# Altium project HIVE_SIGHT.PrjPcb (part 2 of 2)

## Sheet HIVE_SIGHT_WIRELESS.SchDoc
size Tabloid; SheetNumber: 5; SheetTotal: 6; Sheet_Name: WIRELESS; Size: 11x17
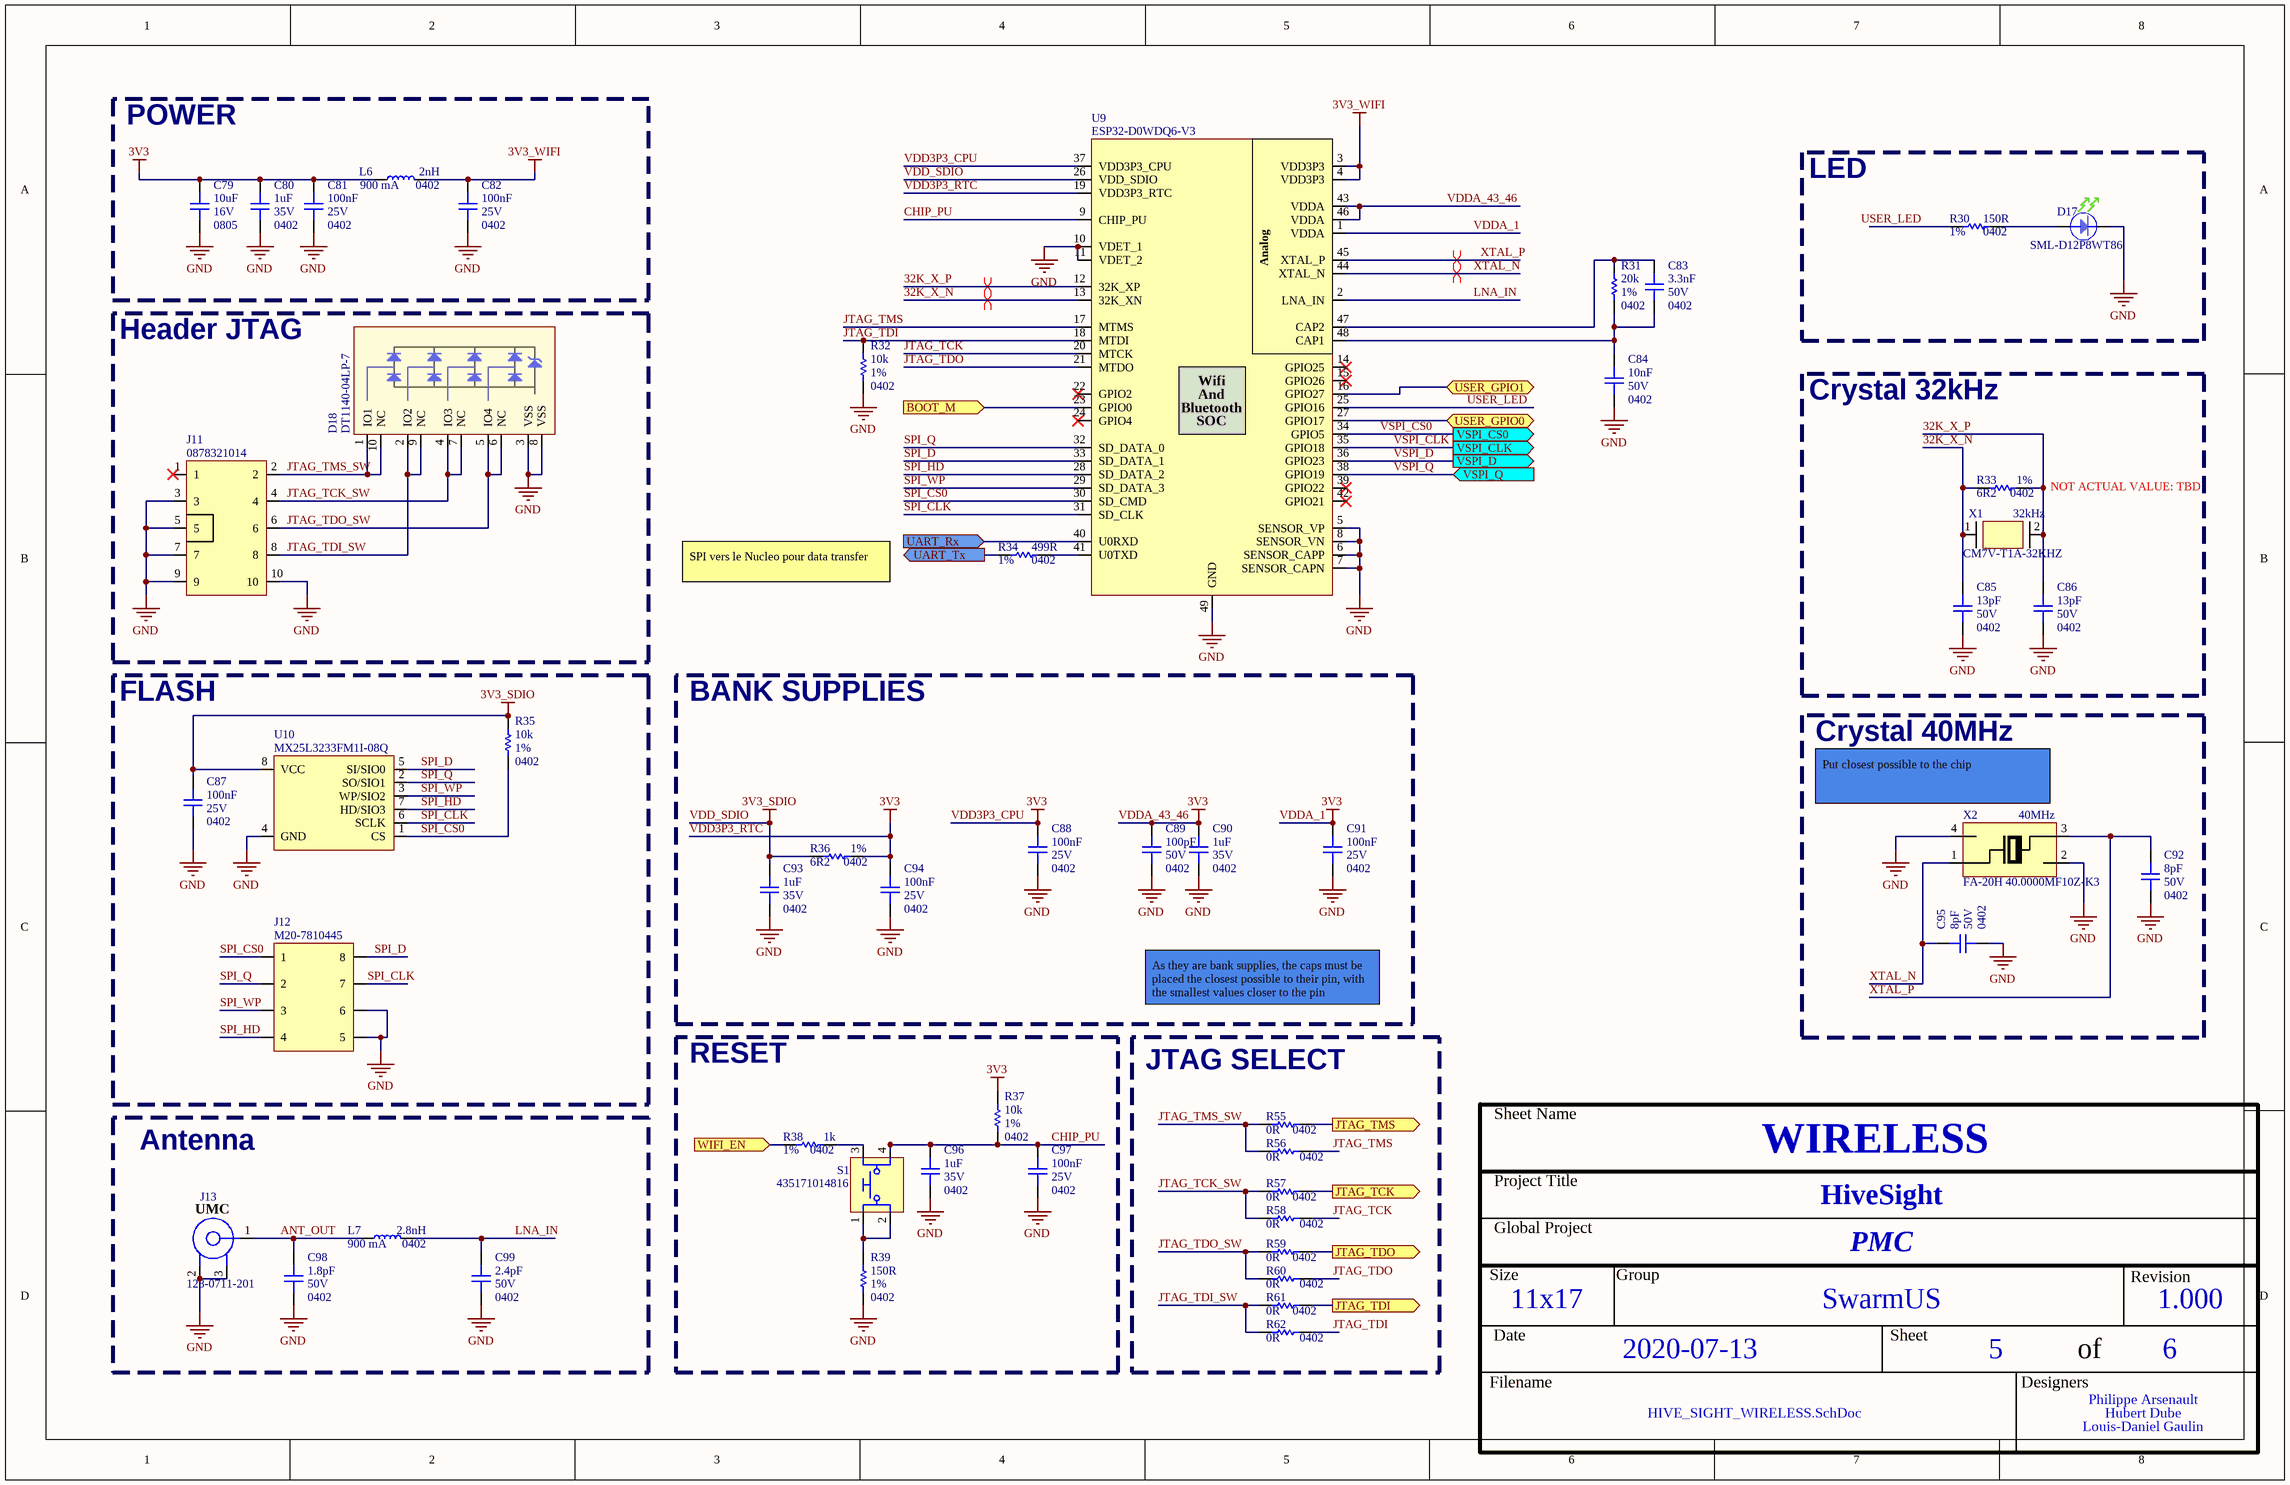
[diagram p3: HIVE_SIGHT_WIRELESS.SchDoc]

### Parts
C79  value 10uF  Package: 0805  Voltage Rating: 16V  [CAP_CER_0805]  (hidden comment: GRM21BR61C106KE15K)
C80  value 1uF  Package: 0402  Voltage Rating: 35V  [CAP_CER_0402]  (hidden comment: CL05A105KL5NRNC)
C81  value 100nF  Package: 0402  Voltage Rating: 25V  [CAP_CER_0402]  (hidden comment: CGA2B3X7R1E104K050BB)
C82  value 100nF  Package: 0402  Voltage Rating: 25V  [CAP_CER_0402]  (hidden comment: CGA2B3X7R1E104K050BB)
C83  value 3.3nF  Package: 0402  Voltage Rating: 50V  [CAP_CER_0402]  (hidden comment: C0402C332K5RACAUTO)
C84  value 10nF  Package: 0402  Voltage Rating: 50V  [CAP_CER_0402]  (hidden comment: CL05B103KB5NFNC)
C85  value 13pF  Package: 0402  Voltage Rating: 50V  [CAP_CER_0402]  (hidden comment: CC0402JRNPO9BN130)
C86  value 13pF  Package: 0402  Voltage Rating: 50V  [CAP_CER_0402]  (hidden comment: CC0402JRNPO9BN130)
C87  value 100nF  Package: 0402  Voltage Rating: 25V  [CAP_CER_0402]  (hidden comment: CGA2B3X7R1E104K050BB)
C88  value 100nF  Package: 0402  Voltage Rating: 25V  [CAP_CER_0402]  (hidden comment: CGA2B3X7R1E104K050BB)
C89  value 100pF  Package: 0402  Voltage Rating: 50V  [CAP_CER_0402]  (hidden comment: CC0402JRNPO9BN101)
C90  value 1uF  Package: 0402  Voltage Rating: 35V  [CAP_CER_0402]  (hidden comment: CL05A105KL5NRNC)
C91  value 100nF  Package: 0402  Voltage Rating: 25V  [CAP_CER_0402]  (hidden comment: CGA2B3X7R1E104K050BB)
C92  value 8pF  Package: 0402  Voltage Rating: 50V  [CAP_CER_0402]  (hidden comment: CC0402DRNPO9BN8R0)
C93  value 1uF  Package: 0402  Voltage Rating: 35V  [CAP_CER_0402]  (hidden comment: CL05A105KL5NRNC)
C94  value 100nF  Package: 0402  Voltage Rating: 25V  [CAP_CER_0402]  (hidden comment: CGA2B3X7R1E104K050BB)
C95  value 8pF  Package: 0402  Voltage Rating: 50V  [CAP_CER_0402]  (hidden comment: CC0402DRNPO9BN8R0)
C96  value 1uF  Package: 0402  Voltage Rating: 35V  [CAP_CER_0402]  (hidden comment: CL05A105KL5NRNC)
C97  value 100nF  Package: 0402  Voltage Rating: 25V  [CAP_CER_0402]  (hidden comment: CGA2B3X7R1E104K050BB)
C98  value 1.8pF  Package: 0402  Voltage Rating: 50V  [CAP_CER_0402]  (hidden comment: CC0402CRNPO9BN1R8)
C99  value 2.4pF  Package: 0402  Voltage Rating: 50V  [CAP_CER_0402]  (hidden comment: CC0402BRNPO9BN2R4)
D17  SML-D12P8WT86  [LED_SML-D12P8WT86]
D18  DT1140-04LP-7  [TVS_DATA_DT1140-04LP-7]
J11  0878321014  [CON_0878321014]
J12  M20-7810445  [CON_HDR_M20-7810445R]
J13  128-0711-201  [CON_UMC_128-0711-201]
L6  value 2nH  Current Rating: 900 mA  Package: 0402  [FER_0402]  (hidden comment: LQG15HS2N0S02D)
L7  value 2.8nH  Current Rating: 900 mA  Package: 0402  [FER_0402]  (hidden comment: LQG15WZ2N8S02D)
R30  value 150R  Tolerance: 1%  Package: 0402  [RES_0402]  (hidden comment: RC0402FR-07150RL)
R31  value 20k  Tolerance: 1%  Package: 0402  [RES_0402]  (hidden comment: RC0402FR-0720KL)
R32  value 10k  Tolerance: 1%  Package: 0402  [RES_0402]  (hidden comment: RC0402FR-0710KL)
R33  value 6R2  Tolerance: 1%  Package: 0402  [RES_0402]  (hidden comment: RC0402FR-076R2L)
R34  value 499R  Tolerance: 1%  Package: 0402  [RES_0402]  (hidden comment: RC0402FR-07499RL)
R35  value 10k  Tolerance: 1%  Package: 0402  [RES_0402]  (hidden comment: RC0402FR-0710KL)
R36  value 6R2  Tolerance: 1%  Package: 0402  [RES_0402]  (hidden comment: RC0402FR-076R2L)
R37  value 10k  Tolerance: 1%  Package: 0402  [RES_0402]  (hidden comment: RC0402FR-0710KL)
R38  value 1k  Tolerance: 1%  Package: 0402  [RES_0402]  (hidden comment: RC0402FR-071KL)
R39  value 150R  Tolerance: 1%  Package: 0402  [RES_0402]  (hidden comment: RC0402FR-07150RL)
R55  value 0R  Package: 0402  [RES_0402]  (hidden comment: RC0402FR-070RL)
R56  value 0R  Package: 0402  [RES_0402]  (hidden comment: RC0402FR-070RL)
R57  value 0R  Package: 0402  [RES_0402]  (hidden comment: RC0402FR-070RL)
R58  value 0R  Package: 0402  [RES_0402]  (hidden comment: RC0402FR-070RL)
R59  value 0R  Package: 0402  [RES_0402]  (hidden comment: RC0402FR-070RL)
R60  value 0R  Package: 0402  [RES_0402]  (hidden comment: RC0402FR-070RL)
R61  value 0R  Package: 0402  [RES_0402]  (hidden comment: RC0402FR-070RL)
R62  value 0R  Package: 0402  [RES_0402]  (hidden comment: RC0402FR-070RL)
S1  435171014816  [SWI_TACT_435171014816]
U9  ESP32-D0WDQ6-V3  [COM_WIFI_ESP32-D0WDQ6-V3]
U10  MX25L3233FM1I-08Q  [MEM_FLASH_MX25L3233FM1I-08Q]
X1  CM7V-T1A-32KHZ  value 32kHz  [CRY_CM7V-T1A-32.768KHZ-12.5PF-20PPM-TA-QC]
X2  FA-20H 40.0000MF10Z-K3  value 40MHz  [CRY_FA-20H 40.0000MF10Z-K3]

### Blocks framed on the sheet
POWER: C79-C82 L6
LED: D17 R30
Header JTAG: D18 J11
Crystal 32kHz: C85 C86 R33 X1
FLASH: C87 J12 R35 U10
BANK SUPPLIES: C88-C91 C93 C94 R36
Crystal 40MHz: C92 C95 X2
JTAG SELECT: R55-R62
Antenna: C98 C99 J13 L7

### Ports
BOOT_M (in), JTAG_TCK (out), JTAG_TDI (out), JTAG_TDO (out), JTAG_TMS (out), UART_Rx (in), UART_Tx (out), USER_GPIO0 (bidir), USER_GPIO1 (bidir), VSPI_CLK (out), VSPI_CS0 (out), VSPI_D (out), VSPI_Q (in), WIFI_EN (in)

### Nets
3V3: C79.2 C80.2 C81.2 C88.2 C89.2 C90.2 C91.2 C94.2 L6.1 R36.1 R37.2 U9.1(VDDA) U9.19(VDD3P3_RTC) U9.37(VDD3P3_CPU) U9.43(VDDA) U9.46(VDDA)  [also labelled VDD3P3_CPU, VDD3P3_RTC, VDDA_1, VDDA_43_46]
3V3_SDIO: C87.2 C93.2 R35.2 R36.2 U9.26(VDD_SDIO) U10.8(VCC)  [also labelled VDD_SDIO]
3V3_WIFI: C82.2 L6.2 U9.3(VDD3P3) U9.4(VDD3P3)
GND: C79.1 C80.1 C81.1 C82.1 C84.1 C85.1 C86.1 C87.1 C88.1 C89.1 C90.1 C91.1 C92.1 C93.1 C94.1 C95.1 C96.1 C97.1 C98.1 C99.1 D17.K D18.3(VSS) D18.8(VSS) J11.3 J11.5 J11.7 J11.9 J11.10 J12.5 J12.6 J13.2 J13.3 R32.1 R39.1 U9.5(SENSOR_VP) U9.6(SENSOR_CAPP) U9.7(SENSOR_CAPN) U9.8(SENSOR_VN) U9.10(VDET_1) U9.11(VDET_2) U9.49(GND) U10.4(GND) X2.2 X2.4
32K_X_N: C85.2 R33.2 U9.13(32K_XN) X1.1(In/Out)
32K_X_P: C86.2 R33.1 U9.12(32K_XP) X1.2(Out/In)
ANT_OUT: C98.2 J13.1 L7.1
CHIP_PU: C96.2 C97.2 R37.1 S1.4 U9.9(CHIP_PU)
JTAG_TCK: R58.1 U9.20(MTCK)
JTAG_TCK_SW: D18.4(IO3) D18.7(NC) J11.4 R57.2 R58.2
JTAG_TDI: R32.2 R62.1 U9.18(MTDI)
JTAG_TDI_SW: D18.2(IO2) D18.9(NC) J11.8 R61.2 R62.2
JTAG_TDO: R60.1 U9.21(MTDO)
JTAG_TDO_SW: D18.5(IO4) D18.6(NC) J11.6 R59.2 R60.2
JTAG_TMS: R56.1 U9.17(MTMS)
JTAG_TMS_SW: D18.1(IO1) D18.10(NC) J11.2 R55.2 R56.2
LNA_IN: C99.2 L7.2 U9.2(LNA_IN)
SPI_CLK: J12.7 U9.31(SD_CLK) U10.6(SCLK)
SPI_CS0: J12.1 R35.1 U9.30(SD_CMD) U10.1(CS)
SPI_D: J12.8 U9.33(SD_DATA_1) U10.5(SI/SIO0)
SPI_HD: J12.4 U9.28(SD_DATA_2) U10.7(HD/SIO3)
SPI_Q: J12.2 U9.32(SD_DATA_0) U10.2(SO/SIO1)
SPI_WP: J12.3 U9.29(SD_DATA_3) U10.3(WP/SIO2)
USER_LED: R30.2 U9.25(GPIO16)
VSPI_CLK: U9.35(GPIO18) ; port VSPI_CLK
VSPI_CS0: U9.34(GPIO5) ; port VSPI_CS0
VSPI_D: U9.36(GPIO23) ; port VSPI_D
VSPI_Q: U9.38(GPIO19) ; port VSPI_Q
XTAL_N: C95.2 U9.44(XTAL_N) X2.1
XTAL_P: C92.2 U9.45(XTAL_P) X2.3
NetC83_1: C83.1 C84.2 R31.1 U9.48(CAP1)
NetC83_2: C83.2 R31.2 U9.47(CAP2)
NetD17_A: D17.A R30.1
NetR34_1: R34.1 U9.41(U0TXD)
NetR34_2: R34.2 ; port UART_Tx
NetR38_1: R38.1 S1.3
NetR38_2: R38.2 ; port WIFI_EN
NetR39_2: R39.2 S1.1 S1.2
NetR55_1: R55.1 ; port JTAG_TMS
NetR57_1: R57.1 ; port JTAG_TCK
NetR59_1: R59.1 ; port JTAG_TDO
NetR61_1: R61.1 ; port JTAG_TDI
NetU9_16: U9.16(GPIO27) ; port USER_GPIO1
NetU9_23: U9.23(GPIO0) ; port BOOT_M
NetU9_27: U9.27(GPIO17) ; port USER_GPIO0
NetU9_40: U9.40(U0RXD) ; port UART_Rx

Not connected (* = marked no-connect by the designer): J11 1*; U9 14(GPIO25)* 15(GPIO26)* 22(GPIO2)* 24(GPIO4)* 39(GPIO22)* 42(GPIO21)*

### Layout directives
differential pair: 32K_X_N, 32K_X_P, XTAL_N, XTAL_P

### Notes on the sheet
- NOT ACTUAL VALUE: TBD
- SPI vers le Nucleo pour data transfer
- (near X2) Put closest possible to the chip
- As they are bank supplies, the caps must be placed the closest possible to their pin, with the smallest values closer to the pin
- RESET
- Sheet Name
- Project Title
- Global Project
- Size
- Group
- Revision
- Date
- Sheet
- of
- Filename
- Designers
- (in symbol COM_WIFI_ESP32-D0WDQ6-V3) Analog; Wifi; And; Bluetooth; SOC
- (in symbol CON_UMC_128-0711-201) UMC

### Library data of the parts
C79 = CAP_CER_GRM21BR61C106KE15K: CAP - CER 10UF 10% 16V X5R - 0805; Manufacturer #1: Murata; GRAMS Lib Spec: 2.8; Magnetic Material: Unknown; Polarized: NO; Assembly Type: SMD; CreatedBy/Date: Caroline Paulin / 8 août 2018; Current Rating: *; HelpURL: https://search.murata.co.jp/Ceramy/image/img/A01X/G101/ENG/GRM21BR61C106KE15-01.pdf; Manufacturer #2: *; Note: *; Part Number #1: GRM21BR61C106KE15K; Part Number #2: *; Power Max: *; Temperature: -55°C ~ 85°C; Tolerance: 10%; VerifiedBy: Nicolas V. (2019-01-22); Supplier 1: Digi-Key; Supplier Part Number 1: 490-6473-1-ND
C80 C90 C93 C96 = CAP_CER_CL05A105KL5NRNC: CAP - CER 1uF 10% 35V X5R - 0402; Manufacturer #1: Samsung Electro-Mechanics; GRAMS Lib Spec: 2.8; Magnetic Material: Unknown; Polarized: NO; Assembly Type: SMD; CreatedBy/Date: Nicolas Roy 2018-10-03; Current Rating: *; HelpURL: http://www.samsungsem.com/kr/support/product-search/mlcc/__icsFiles/afieldfile/2018/06/19/CL05A105KL5NRNC.pdf; Manufacturer #2: *; Part Number #1: CL05A105KL5NRNC; Part Number #2: *; Power Max: *; Temperature: -55°C ~ 85°C; Tolerance: 10%; VerifiedBy: Caroline Paulin - 18 janv 2019; Supplier 1: Digi-Key; Supplier Part Number 1: 1276-6796-1-ND; Cryo: UNKNOWN
C81 C82 C87 C88 C91 C94 C97 = CAP_CER_CGA2B3X7R1E104K050BB: CAP - CER 0.1µF 10% 25V X7R - 0402; Manufacturer #1: TDK Corporation; GRAMS Lib Spec: 2.8; Magnetic Material: Unknown; Polarized: NO; Assembly Type: SMD; CreatedBy/Date: Nicolas Roy 2018-11-07; Current Rating: *; HelpURL: https://product.tdk.com/info/en/catalog/datasheets/mlcc_automotive_general_en.pdf; Manufacturer #2: *; Note: *; Part Number #1: CGA2B3X7R1E104K050BB; Part Number #2: *; Power Max: *; Temperature: -55°C ~ 125°C; Tolerance: 10%; VerifiedBy: Nicolas V. (2019-01-22); Supplier 1: Digi-Key; Supplier Part Number 1: 445-6902-1-ND; Cryo: UNKNOWN
C83 = CAP_CER_C0402C332K5RACAUTO: CAP - CER 3.3nF 10% 50V X7R - 0402; Manufacturer #1: KEMET; GRAMS Lib Spec: 2.9; Magnetic Material: Unknown; Polarized: No; Assembly Type: SMD; CreatedBy/Date: Patrick Dufour 2020-05-29; Current Rating: *; HelpURL: https://content.kemet.com/datasheets/KEM_C1023_X7R_AUTO_SMD.pdf; Manufacturer #2: *; Note: *; Part Number #1: C0402C332K5RACAUTO; Part Number #2: *; Power Max: *; Temperature: -55°C ~ 125°C; Tolerance: 10%; VerifiedBy: C.Paulin - 2020-06-24; Supplier 1: Digi-Key; Supplier Part Number 1: 399-15992-2-ND; Cryo: Unknown
C84 = CAP_CER_CL05B103KB5NFNC: CAP - CER 10nF ±10% 50V X7R - 0402; Manufacturer #1: Samsung Electro-Mechanics; GRAMS Lib Spec: 2.8; Magnetic Material: Unknown; Polarized: No; Assembly Type: SMD; CreatedBy/Date: Keven Deslandes - 2018/11/20; Current Rating: *; HelpURL: http://www.samsungsem.com/kr/support/product-search/mlcc/CL05B103KB5NFNC.jsp; Manufacturer #2: *; Note: *; Part Number #1: CL05B103KB5NFNC; Part Number #2: *; Power Max: *; Temperature: -55°C ~ 125°C; Tolerance: 10%; VerifiedBy: Nicolas Roy - 2018/12/11; Supplier 1: Digi-Key; Supplier Part Number 1: 1276-1499-1-ND; Cryo: UNKNOWN
C85 C86 = CAP_CER_CC0402JRNPO9BN130: CAP - CER 13PF 50V C0G/NP0 - 0402; Manufacturer #1: Yageo; Tolerance: ±5%; GRAMS Lib Spec: 2.8; Magnetic Material: Unknown; Polarized: NO; Current Rating: *; Power Max: *; HelpURL: https://www.yageo.com/upload/media/product/productsearch/datasheet/mlcc/UPY-GP_NP0_16V-to-50V_18.pdf; CreatedBy/Date: Hubert Dube - 04/10/20; VerifiedBy: Louis-Daniel Gaulin - 09/11/2020; Temperature: -55°C ~ 125°C; Manufacturer #2: *; Assembly Type: SMD; Part Number #2: *; Part Number #1: CC0402JRNPO9BN130; Cryo: UNKNOWN; Supplier 1: Digi-Key; Supplier Part Number 1: 311-3754-1-ND
C89 = CAP_CER_CC0402JRNPO9BN101: CAP - CER 100pF 50V ±5% C0G,CP0 - 0402; Manufacturer #1: Yageo; GRAMS Lib Spec: 2.8; Magnetic Material: Unknown; Polarized: NO; Assembly Type: SMD; CreatedBy/Date: Philippe Arsenault/ 2020-07-24; Current Rating: *; HelpURL: https://www.yageo.com/upload/media/product/productsearch/datasheet/mlcc/UPY-GPHC_X7R_6.3V-to-50V_18.pdf; Manufacturer #2: *; Note: *; Part Number #1: CC0402JRNPO9BN101; Part Number #2: *; Power Max: *; Temperature: -55°C ~ 125°C; Tolerance: ±5%; VerifiedBy: Louis-Daniel Gaulin / 2020-07-29; Cryo: UNKNOWN; Supplier 1: Digi-Key; Supplier Part Number 1: 311-1024-1-ND
C92 C95 = CAP_CER_CC0402DRNPO9BN8R0: CAP - CER 8PF 50V C0G/NP0 - 0402; Manufacturer #1: Yageo; Tolerance: ±0.5pF; GRAMS Lib Spec: 2.8; Magnetic Material: Unknown; Polarized: NO; Current Rating: *; Power Max: *; HelpURL: https://www.yageo.com/upload/media/product/productsearch/datasheet/mlcc/UPY-GP_NP0_16V-to-50V_18.pdf; CreatedBy/Date: Hubert Dube - 04/10/20; VerifiedBy: Louis-Daniel Gaulin - 09/11/2020; Temperature: -55°C ~ 125°C; Manufacturer #2: *; Assembly Type: SMD; Part Number #2: *; Part Number #1: CC0402DRNPO9BN8R0; Cryo: UNKNOWN; Supplier 1: Digi-Key; Supplier Part Number 1: 311-1639-1-ND
C98 = CAP_CER_CC0402CRNPO9BN1R8: CAP - CER 1.8PF 50V C0G/NP0 - 0402; Manufacturer #1: Yageo; Tolerance: ±0.25pF; GRAMS Lib Spec: 2.8; Magnetic Material: Unknown; Polarized: NO; Current Rating: *; Power Max: *; HelpURL: https://www.yageo.com/upload/media/product/productsearch/datasheet/mlcc/UPY-GP_NP0_16V-to-50V_18.pdf; CreatedBy/Date: Hubert Dube - 04/10/20; VerifiedBy: Louis-Daniel Gaulin - 09/11/2020; Temperature: -55°C ~ 125°C; Manufacturer #2: *; Assembly Type: SMD; Part Number #2: *; Part Number #1: CC0402CRNPO9BN1R8; Cryo: UNKNOWN; Supplier 1: Digi-Key; Supplier Part Number 1: 311-1004-1-ND
C99 = CAP_CER_CC0402BRNPO9BN2R4: CAP - CER 2.4PF 50V C0G/NP0 - 0402; Manufacturer #1: Yageo; Tolerance: ±0.1pF; GRAMS Lib Spec: 2.8; Magnetic Material: Unknown; Polarized: NO; Current Rating: *; Power Max: *; HelpURL: https://www.yageo.com/upload/media/product/productsearch/datasheet/mlcc/UPY-GP_NP0_16V-to-50V_18.pdf; CreatedBy/Date: Hubert Dube - 04/10/20; VerifiedBy: Louis-Daniel Gaulin - 09/11/2020; Temperature: -55°C ~ 125°C; Manufacturer #2: *; Assembly Type: SMD; Part Number #2: *; Part Number #1: CC0402BRNPO9BN2R4; Cryo: UNKNOWN; Supplier 1: Digi-Key; Supplier Part Number 1: 311-3703-1-ND
D17 = LED_SML-D12P8WT86: LED - GREEN DIFFUSED 0603 SMD - 0603; Manufacturer #1: Rohm Semiconductor; Current Rating: 1-20mA; Note: Operate at 2mA; Value: 560 nm (green); Voltage rating: 2.2V (Forward), 5V (max Reverse); Polarized: Yes; Magnetic Material: Unknown; GRAMS Lib Spec: 2.8; Manufacturer #2: *; Power Max: *; Part Number #1: SML-D12P8WT86; Part Number #2: *; HelpURL: https://d1d2qsbl8m0m72.cloudfront.net/en/products/databook/datasheet/opto/led/chip_mono/sml-d12x8_d13x8-e.pdf; Supplier 1: Digi-Key; Supplier Part Number 1: 511-1579-2-ND; Assembly Type: SMD; Temperature: -40 ~ 85 °C; Package: 0603; CreatedBy/Date: Keven Deslandes - 2018/11/21; Tolerance: *; VerifiedBy: Caroline Paulin - 13 février 2019; Cryo: UNKNOWN
D18 = TVS_DATA_DT1140-04LP-7: TVS - DIODE 5.5V 10V - 10-UFDFN; Manufacturer #1: Diodes Incorporated; Value: 5.5V @ 1mA (Reverse Standoff); Voltage Rating: 6V (Breakdown); Current Rating: 6A (8/20µs); Power Max: 60W (8/20µs); GRAMS Lib Spec: 2.8; Note: Fooprint created from tpd4e05u06 (TI) for manufacturability (soldermask); Magnetic Material: Unknown; Polarized: Yes; Tolerance: -; HelpURL: https://www.diodes.com/assets/Datasheets/DT1140-04LP.pdf; CreatedBy/Date: Joël Lemay 2019-11-20; VerifiedBy: C.Paulin - 21/11/2019; Temperature: -55°C~85°C; Package: 10-UFDFN; Manufacturer #2: -; Assembly Type: SMD; Part Number #2: -; Part Number #1: DT1140-04LP-7; Supplier 1: Digi-Key; Supplier Part Number 1: DT1140-04LP-7DICT-ND; Cryo: UNKNOWN
J11 = CON_0878321014: CON - HEADER SMD 10POS 2mm - SMD; Manufacturer #1: Molex; GRAMS Lib Spec: 2.8; Magnetic Material: Unknown; Polarized: YES; Value: *; Tolerance: *; Voltage Rating: *; Current Rating: *; Power Max: *; HelpURL: https://www.molex.com/webdocs/datasheets/pdf/en-us/0878321014_PCB_HEADERS.pdf; CreatedBy/Date: Hubert Dube - 8/10/2020; VerifiedBy: Louis-Daniel Gaulin / 12-11-2020; Temperature: -55°C ~ 105 °C; Package: SMD; Manufacturer #2: *; Assembly Type: SMD; Part Number #2: *; Part Number #1: 0878321014; Cryo: UNKNOWN; Supplier 1: Digi-Key; Supplier Part Number 1: WM14376CT-ND
J12 = CON_HDR_M20-7810445: CONN RCPT 8POS 0.1 GOLD SMD; Manufacturer #1: Harwin Inc.; GRAMS Lib Spec: 2.8; Magnetic Material: Unknown; Polarized: NO; Value: *; Tolerance: *; Voltage Rating: *; Current Rating: *; Power Max: *; HelpURL: https://cdn.harwin.com/pdfs/M20-781.pdf; CreatedBy/Date: Hubert Dube - 31/10/2020; VerifiedBy: Louis-Daniel Gaulin - 09/11/2020; Temperature: -40°C ~ 105°C; Package: SMD; Manufacturer #2: *; Assembly Type: SMD; Part Number #2: *; Part Number #1: M20-7810445; Cryo: UNKNOWN; Supplier 1: Digi-Key; Supplier Part Number 1: 952-3209-ND
J13 = CON_UMC_128-0711-201: CON - UMC JACK STR 50 OHM - SMD; Manufacturer #1: Cinch Connectivity Solutions Johnson; Note: Straight; Value: 50 Ohm, 6 GHz; Voltage rating: 200V; Polarized: No; GRAMS Lib Spec: 2.8; Cryo: UNKNOWN; Current Rating: *; Manufacturer #2: *; Power Max: *; Part Number #1: 128-0711-201; Part Number #2: *; HelpURL: https://belfuse.com/resources/cinch-brochures/CCS%20Johnson%20UMC%20Ultra%20Miniature%20Connectors.pdf; Supplier 1: Digi-Key; Supplier Part Number 1: J983CT-ND; Assembly Type: SMD; Magnetic Material: *; Temperature: -40°C ~ 90°C; Package: SMD; CreatedBy/Date: Keven Desandes - 2018/09/27; Tolerance: *; VerifiedBy: Caroline Paulin - 23 janv 2019
L6 = IND_LQG15HS2N0S02D: IND - 2nH 900mA 100mOhm  - 0402; Manufacturer #1: Murata Electronics; Tolerance: 0.3nH; GRAMS Lib Spec: 2.8; Magnetic Material: Unknown; Polarized: NO; Voltage Rating: *; Power Max: *; HelpURL: https://search.murata.co.jp/Ceramy/image/img/P02/JELF243B-0010.pdf; CreatedBy/Date: Hubert Dube  - 21/07/20; VerifiedBy: Louis-Daniel Gaulin - 09/11/2020; Temperature: -55°C ~ 125°C; Manufacturer #2: *; Assembly Type: SMD; Part Number #2: *; Part Number #1: LQG15HS2N0S02D; Cryo: UNKNOWN; Supplier 1: Digi-Key; Supplier Part Number 1: 490-6569-1-ND
L7 = IND_LQG15WZ2N8S02D: IND - 2.8nH 900mA 80mOhm  - 0402; Manufacturer #1: Murata Electronics; Tolerance: 0.3nH; GRAMS Lib Spec: 2.8; Magnetic Material: Unknown; Polarized: NO; Voltage Rating: *; Power Max: *; HelpURL: https://search.murata.co.jp/Ceramy/image/img/P02/JELF243B-9117.pdf; CreatedBy/Date: Hubert Dube  - 3/10/20; VerifiedBy: Louis-Daniel Gaulin - 09/11/2020; Temperature: -55°C ~ 125°C; Manufacturer #2: *; Assembly Type: SMD; Part Number #2: *; Part Number #1: LQG15WZ2N8S02D; Cryo: UNKNOWN; Supplier 1: Digi-Key; Supplier Part Number 1: 490-LQG15WZ2N8S02DCT-ND
R30 R39 = RES_RC0402FR-07150RL: RES - 150R 1% 1/16W - 0402; Manufacturer #1: Yageo; GRAMS Lib Spec: 2.8; Magnetic Material: Unknown; Polarized: No; Voltage Rating: 50V; Assembly Type: SMD; CreatedBy/Date: Jonathan Bouchard 2019-03-25; Current Rating: *; HelpURL: http://www.yageo.com/documents/recent/PYu-RC_Group_51_RoHS_L_10.pdf; Manufacturer #2: *; Part Number #1: RC0402FR-07150RL; Part Number #2: *; Power Max: 1/16W; Temperature: -55°C ~ 155°C; VerifiedBy: Nicolas V. (2019-05-02); Supplier 1: Digi-Key; Supplier Part Number 1: 311-150LRCT-ND; Cryo: UNKNOWN
R31 = RES_RC0402FR-0720KL: RES - 20K 1% 1/16W  - 0402; Manufacturer #1: Yageo; GRAMS Lib Spec: 2.8; Magnetic Material: Unknown; Polarized: No; Voltage Rating: 50V; Assembly Type: SMD; CreatedBy/Date: Keven Deslandes 2018-10-18; Current Rating: *; HelpURL: http://www.yageo.com/documents/recent/PYu-RC_Group_51_RoHS_L_10.pdf; Manufacturer #2: *; Note: *; Part Number #1: RC0402FR-0720KL; Part Number #2: *; Power Max: 1/16W; Temperature: -55°C ~ 155°C; VerifiedBy: Caroline Paulin - 7 janv 2019; Supplier 1: Digi-Key; Supplier Part Number 1: 311-20.0KLRCT-ND; Cryo: UNKNOWN
R32 R35 R37 = RES_RC0402FR-0710KL: RES - 10K OHMS 1% 1/16W - 0402; Manufacturer #1: Yageo; GRAMS Lib Spec: 2.8; Magnetic Material: UNKNOWN; Polarized: NO; Voltage Rating: 50V; Assembly Type: SMD; CreatedBy/Date: Nicolas V. (2018-11-20); Current Rating: *; HelpURL: http://www.yageo.com/documents/recent/PYu-RC_Group_51_RoHS_L_9.pdf; Manufacturer #2: *; Note: *; Part Number #1: RC0402FR-0710KL; Part Number #2: *; Power Max: 1/16W; Temperature: -55°C ~ 155°C; VerifiedBy: Nicolas V. (2018-11-20); Supplier 1: Digi-Key; Supplier Part Number 1: 311-10.0KLRCT-ND; Cryo: UNKNOWN
R33 R36 = RES_RC0402FR-076R2L: RES - 6.2R 1% 1/16W - 0402; Manufacturer #1: Yageo; Part Number #1: RC0402JR-076R2L; GRAMS Lib Spec: 2.8c; Magnetic Material: Unknown; Polarized: No; Voltage Rating: 50V; Assembly Type: SMD; CreatedBy/Date: Hubert Dubé 04/10/2020; Current Rating: *; HelpURL: https://www.yageo.com/upload/media/product/productsearch/datasheet/rchip/PYu-RC_Group_51_RoHS_L_11.pdf; Manufacturer #2: *; Note: *; Part Number #2: *; Power Max: 1/16W; Temperature: -55°C ~ 155°C; VerifiedBy: Louis-Daniel Gaulin - 09/11/2020; Supplier 1: Digi-Key; Supplier Part Number 1: 13-RC0402FR-076R2LCT-ND
R34 = RES_RC0402FR-07499RL: RES - 499 OHM 1% 1/16W - 0402; Manufacturer #1: Yageo; GRAMS Lib Spec: 2.8; Magnetic Material: Unknown; Polarized: NO; Voltage Rating: 50V; Assembly Type: SMD; CreatedBy/Date: Nicolas Roy/05 dec. 2018; Current Rating: *; HelpURL: http://www.yageo.com/documents/recent/PYu-RC_Group_51_RoHS_L_10.pdf; Manufacturer #2: *; Note: *; Part Number #1: RC0402FR-07499RL; Part Number #2: *; Power Max: 1/16W; Temperature: -55°C ~ 155°C; VerifiedBy: Charles Richard 14-01-2019; Supplier 1: Digi-Key; Supplier Part Number 1: 311-499LRCT-ND; Cryo: UNKNOWN
R38 = RES_RC0402FR-071KL: RES - 1K OHM 1% 1/16W - 0402; Manufacturer #1: Yageo; GRAMS Lib Spec: 2.8; Magnetic Material: YES; Polarized: NO; Voltage Rating: 50V; Cryo: UNKNOWN; Assembly Type: SMD; CreatedBy/Date: Jonathan Bouchard 2018-07-05; Current Rating: *; HelpURL: http://www.yageo.com/documents/recent/PYu-RC_Group_51_RoHS_L_9.pdf; Manufacturer #2: *; Note: *; Part Number #1: RC0402FR-071KL; Part Number #2: *; Power Max: 1/16W; Temperature: -55°C ~ 155°C; VerifiedBy: Arnaud Samson 16-07-18; Supplier 1: Digi-Key; Supplier Part Number 1: 311-1.00KLRCT-ND
R55-R62 = RES_RC0402FR-070RL: RES - 0R 1/16W 1A  - 0402; Manufacturer #1: Yageo; GRAMS Lib Spec: 2.8; Magnetic Material: Unknown; Polarized: No; Voltage Rating: 50V; Assembly Type: SMD; CreatedBy/Date: Keven Deslandes 2018-09-12; Current Rating: 1A; HelpURL: http://www.yageo.com/documents/recent/PYu-RC_Group_51_RoHS_L_10.pdf; Manufacturer #2: *; Note: *; Part Number #1: RC0402FR-070RL; Part Number #2: *; Power Max: 1/16W; Temperature: -55°C ~ 155°C; VerifiedBy: Caroline Paulin - 27 fév 2019; Supplier 1: Digi-Key; Supplier Part Number 1: 311-0.0LRCT-ND; Cryo: UNKNOWN
S1 = SWI_TACT_435171014816: SWI - SWITCH TACTILE SPST-NO 0.05A 12V -SMD; Manufacturer #1: Würth Elektronik; Current Rating: 50mA; Voltage rating: 12VDC; Polarized: No; Magnetic Material: UNKNOWN; GRAMS Lib Spec: 2.8; Manufacturer #2: *; Power Max: *; Value: SPST-NO; Part Number #1: 435171014816; Part Number #2: *; HelpURL: https://www.we-online.com/catalog/datasheet/435171014816.pdf; Supplier 1: Digi-Key; Supplier Part Number 1: 732-435171014816CT-ND; Assembly Type: SMD; Temperature: -40°C ~ 85°C; Package: SMD; CreatedBy/Date: Hubert Dube - 22/07/20; Tolerance: *; VerifiedBy: Louis-Daniel Gaulin / 12-11-2020; Cryo: UNKNOWN
U9 = COM_WIFI_ESP32-D0WDQ6-V3: COM_WIFI - IC RF TxRx + MCU, WiFi 802.11b/g/n, Bluetooth 4.2 2.4GHz - 48-VFQFN Exposed Pad; Manufacturer #1: Espressif Systems; Voltage Rating: 2.3-3.63; Current Rating: Rx 100mA/Tx 240mA; Power Max: 900mW; GRAMS Lib Spec: 2.8; Magnetic Material: Unknown; Polarized: Yes; Cryo: No; Value: *; Tolerance: *; HelpURL: https://www.espressif.com/sites/default/files/documentation/esp32_datasheet_en.pdf; CreatedBy/Date: Louis-Daniel Gaulin / 10-12-2020; VerifiedBy: Hubert Dube - 14/12/2020; Temperature: -40°C ~ 125°C; Package: 48-VFQFN 6x6; Manufacturer #2: *; Note: *; Assembly Type: SMD; Part Number #2: *; Part Number #1: ESP32-D0WDQ6-V3; Supplier 1: Digi-Key; Supplier Part Number 1: 1904-ESP32-D0WDQ6-V3CT-ND
U10 = MEM_FLASH_MX25L3233FM1I-08Q: MEM - EFLASH 32Mb SPI 133MHZ - 8-SOIC; Manufacturer #1: Macronix; Value: 32Mb (8M x 4); Voltage Rating: 2.65V ~ 3.6V; GRAMS Lib Spec: 2.8; Magnetic Material: UNKNOWN; Polarized: YES; Tolerance: *; Current Rating: *; Power Max: *; HelpURL: https://www.macronix.com/Lists/Datasheet/Attachments/7426/MX25L3233F,%203V,%2032Mb,%20v1.6.pdf; CreatedBy/Date: Hubert Dube - 22/07/01; Temperature: -40°C ~ 85°C; Package: 8-WSON; Manufacturer #2: *; Note: *; Assembly Type: SMD; Part Number #2: *; Part Number #1: MX25L3233FM1I-08Q; Cryo: UNKNOWN; Supplier 1: Digi-Key; Supplier Part Number 1: 1092-1221-ND
X1 = CRY_CM7V-T1A-32.768KHZ-12.5PF-20PPM-TA-QC: CRY - 32.768KHZ tol:20ppm 12.5PF - 2-SMD; Manufacturer #1: Micro Crystal AG; Magnetic Material: Unknown; Polarized: No; GRAMS Lib Spec: 2.8; Tolerance: ±20ppm; Assembly Type: SMD; Current Rating: *; Manufacturer #2: *; Note: *; Part Number #1: CM7V-T1A-32.768KHZ-12.5PF-20PPM-TA-QC; Part Number #2: *; Package: 2-SMD, No Lead; Power Max: *; Voltage rating: *; Temperature: -40°C ~ 85°C; HelpURL: https://www.microcrystal.com/fileadmin/Media/Products/32kHz/Datasheet/CM7V-T1A.pdf; CreatedBy/Date: Hubert Dube - 21/07/20; VerifiedBy: Louis-Daniel Gaulin - 09/11/2020; Cryo: UNKNOWN; Supplier 1: Digi-Key; Supplier Part Number 1: 2195-CM7V-T1A-32.768KHZ-12.5PF-20PPM-TA-QCCT-ND
X2 = CRY_FA-20H 40.0000MF10Z-K3: CRY - 40MKHZ 10ppm 10PF - 4-SMD; Manufacturer #1: EPSON; Magnetic Material: Unknown; Polarized: No; GRAMS Lib Spec: 2.8; Assembly Type: SMD; Current Rating: *; Manufacturer #2: *; Note: *; Part Number #1: FA-20H 40.0000MF10Z-K3; Part Number #2: *; Package: 4 - SMD, No Lead; Power Max: *; Voltage rating: *; Temperature: -20°C ~ 75°C; HelpURL: https://support.epson.biz/td/api/doc_check.php?dl=brief_FA-20H&lang=en; CreatedBy/Date: Hubert Dube - 21/07/20; Tolerance: ±10ppm; VerifiedBy: Louis-Daniel Gaulin - 09/11/2020; Cryo: UNKNOWN; Supplier 1: Digi-Key; Supplier Part Number 1: SER4045CT-ND

## Nets that join several sheets
3V3: HIVE_SIGHT_WROOM (5 pins), HIVE_SIGHT_MISC (18 pins), HIVE_SIGHT_WIRELESS (16 pins)
GND: HIVE_SIGHT_WROOM (14 pins), HIVE_SIGHT_MISC (24 pins), HIVE_SIGHT_WIRELESS (44 pins)